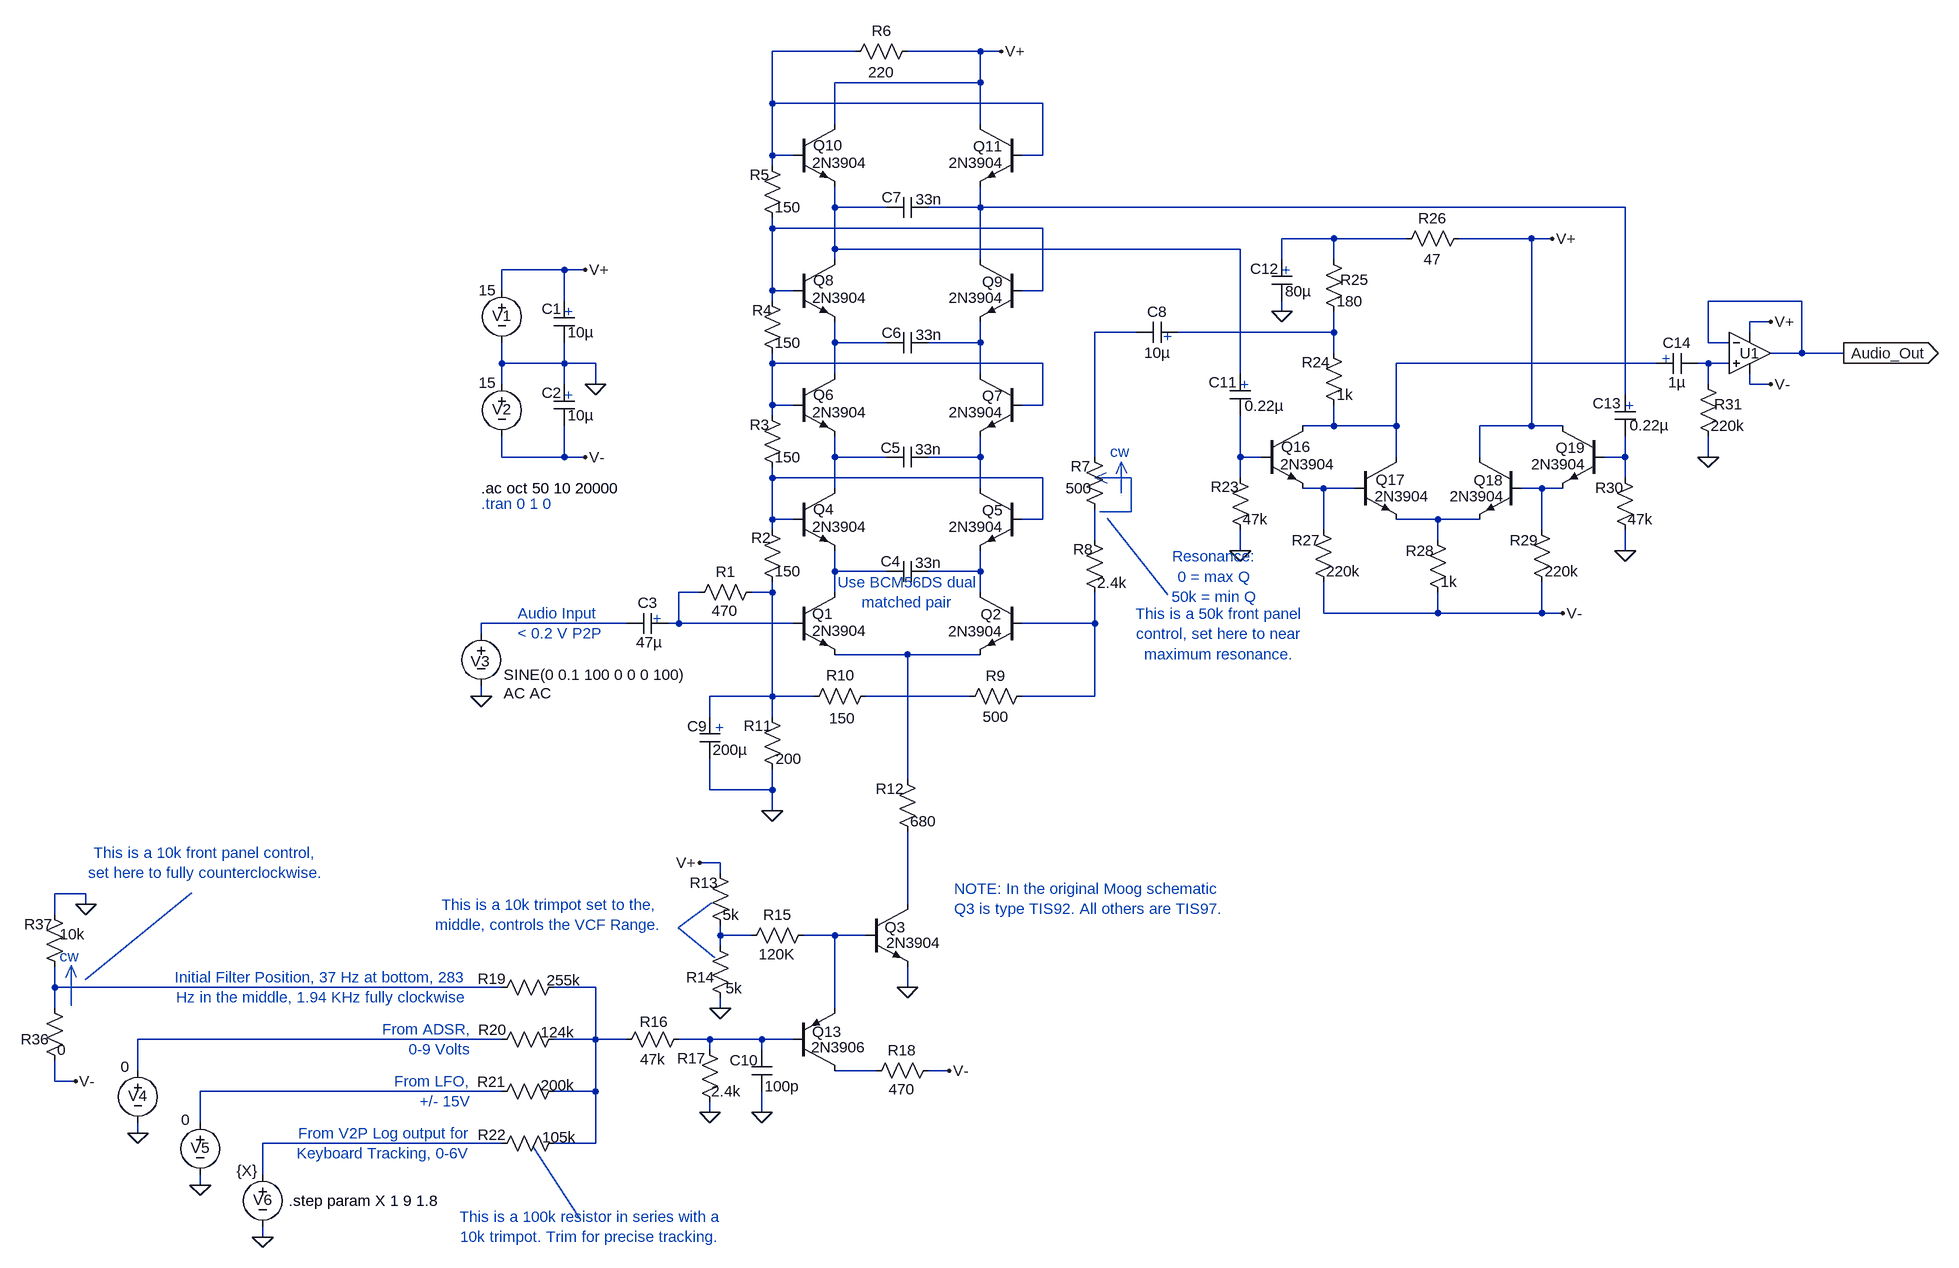
[diagram p0: schematic VCF-simulation.asc]
VCF-simulation.asc, the LTspice schematic file:
Version 4
SHEET 1 3972 1940
WIRE 1392 16 1264 16
WIRE 1584 16 1472 16
WIRE 1616 16 1584 16
WIRE 1584 64 1584 16
WIRE 1584 64 1360 64
WIRE 1264 96 1264 16
WIRE 1680 96 1264 96
WIRE 1360 128 1360 64
WIRE 1584 128 1584 64
WIRE 1264 176 1264 96
WIRE 1296 176 1264 176
WIRE 1680 176 1680 96
WIRE 1680 176 1648 176
WIRE 1264 192 1264 176
WIRE 1360 256 1360 224
WIRE 1440 256 1360 256
WIRE 1584 256 1584 224
WIRE 1584 256 1504 256
WIRE 2576 256 1584 256
WIRE 1264 288 1264 272
WIRE 1680 288 1264 288
WIRE 2128 304 2048 304
WIRE 2240 304 2128 304
WIRE 2432 304 2320 304
WIRE 2464 304 2432 304
WIRE 1360 320 1360 256
WIRE 1984 320 1360 320
WIRE 1360 336 1360 320
WIRE 1584 336 1584 256
WIRE 2048 336 2048 304
WIRE 2128 336 2128 304
WIRE 944 352 848 352
WIRE 976 352 944 352
WIRE 848 384 848 352
WIRE 1264 384 1264 288
WIRE 1296 384 1264 384
WIRE 1680 384 1680 288
WIRE 1680 384 1648 384
WIRE 944 400 944 352
WIRE 1264 400 1264 384
WIRE 2848 400 2704 400
WIRE 2048 416 2048 400
WIRE 2800 432 2768 432
WIRE 1824 448 1760 448
WIRE 2128 448 2128 416
WIRE 2128 448 1888 448
WIRE 2768 448 2768 432
WIRE 1360 464 1360 432
WIRE 1440 464 1360 464
WIRE 1584 464 1584 432
WIRE 1584 464 1504 464
WIRE 2704 464 2704 400
WIRE 2736 464 2704 464
WIRE 2128 480 2128 448
WIRE 2848 480 2848 400
WIRE 2848 480 2800 480
WIRE 2912 480 2848 480
WIRE 848 496 848 464
WIRE 944 496 944 464
WIRE 944 496 848 496
WIRE 992 496 944 496
WIRE 1264 496 1264 480
WIRE 1680 496 1264 496
WIRE 2624 496 2224 496
WIRE 2704 496 2688 496
WIRE 2736 496 2704 496
WIRE 1360 512 1360 464
WIRE 1584 512 1584 464
WIRE 1984 512 1984 320
WIRE 848 528 848 496
WIRE 944 528 944 496
WIRE 992 528 992 496
WIRE 2704 528 2704 496
WIRE 2768 528 2768 512
WIRE 2800 528 2768 528
WIRE 2576 544 2576 256
WIRE 1264 560 1264 496
WIRE 1296 560 1264 560
WIRE 1680 560 1680 496
WIRE 1680 560 1648 560
WIRE 1264 576 1264 560
WIRE 2128 592 2128 560
WIRE 2128 592 2080 592
WIRE 2224 592 2224 496
WIRE 2224 592 2128 592
WIRE 2432 592 2432 304
WIRE 2432 592 2352 592
WIRE 2480 592 2432 592
WIRE 848 640 848 608
WIRE 944 640 944 592
WIRE 944 640 848 640
WIRE 976 640 944 640
WIRE 1360 640 1360 608
WIRE 1440 640 1360 640
WIRE 1584 640 1584 608
WIRE 1584 640 1504 640
WIRE 1760 640 1760 448
WIRE 1984 640 1984 576
WIRE 2016 640 1984 640
WIRE 2224 640 2224 592
WIRE 2352 640 2352 592
WIRE 2576 640 2576 608
WIRE 2576 640 2544 640
WIRE 2704 640 2704 608
WIRE 1264 672 1264 656
WIRE 1680 672 1264 672
WIRE 1984 672 1984 640
WIRE 2576 672 2576 640
WIRE 1360 688 1360 640
WIRE 1584 688 1584 640
WIRE 2112 688 2080 688
WIRE 2160 688 2112 688
WIRE 2448 688 2416 688
WIRE 2480 688 2448 688
WIRE 1264 736 1264 672
WIRE 1296 736 1264 736
WIRE 1680 736 1680 672
WIRE 1680 736 1648 736
WIRE 2288 736 2224 736
WIRE 2352 736 2288 736
WIRE 1264 752 1264 736
WIRE 2112 752 2112 688
WIRE 2448 752 2448 688
WIRE 1760 768 1760 720
WIRE 2288 768 2288 736
WIRE 1984 784 1984 752
WIRE 2576 784 2576 752
WIRE 1360 816 1360 784
WIRE 1440 816 1360 816
WIRE 1584 816 1584 784
WIRE 1584 816 1504 816
WIRE 1152 848 1120 848
WIRE 1264 848 1264 832
WIRE 1264 848 1232 848
WIRE 1360 848 1360 816
WIRE 1584 848 1584 816
WIRE 2112 880 2112 832
WIRE 2288 880 2288 848
WIRE 2288 880 2112 880
WIRE 2448 880 2448 832
WIRE 2448 880 2288 880
WIRE 2480 880 2448 880
WIRE 1040 896 816 896
WIRE 1120 896 1120 848
WIRE 1120 896 1104 896
WIRE 1296 896 1120 896
WIRE 1760 896 1760 848
WIRE 1760 896 1648 896
WIRE 816 912 816 896
WIRE 1472 944 1360 944
WIRE 1584 944 1472 944
WIRE 816 1008 816 992
WIRE 1264 1008 1264 848
WIRE 1264 1008 1168 1008
WIRE 1328 1008 1264 1008
WIRE 1568 1008 1408 1008
WIRE 1760 1008 1760 896
WIRE 1760 1008 1648 1008
WIRE 1168 1040 1168 1008
WIRE 1264 1040 1264 1008
WIRE 1472 1136 1472 944
WIRE 1168 1152 1168 1104
WIRE 1264 1152 1264 1120
WIRE 1264 1152 1168 1152
WIRE 1264 1184 1264 1152
WIRE 1184 1264 1152 1264
WIRE 1184 1280 1184 1264
WIRE 208 1312 160 1312
WIRE 208 1328 208 1312
WIRE 1472 1328 1472 1216
WIRE 160 1344 160 1312
WIRE 1184 1376 1184 1360
WIRE 1232 1376 1184 1376
WIRE 1360 1376 1312 1376
WIRE 1408 1376 1360 1376
WIRE 1184 1392 1184 1376
WIRE 160 1456 160 1424
WIRE 848 1456 160 1456
WIRE 992 1456 928 1456
WIRE 1472 1456 1472 1424
WIRE 160 1488 160 1456
WIRE 1184 1488 1184 1472
WIRE 1360 1488 1360 1376
WIRE 848 1536 288 1536
WIRE 992 1536 992 1456
WIRE 992 1536 928 1536
WIRE 1040 1536 992 1536
WIRE 1168 1536 1120 1536
WIRE 1248 1536 1168 1536
WIRE 1296 1536 1248 1536
WIRE 1168 1552 1168 1536
WIRE 1248 1552 1248 1536
WIRE 288 1584 288 1536
WIRE 1424 1584 1360 1584
WIRE 1536 1584 1504 1584
WIRE 160 1600 160 1568
WIRE 192 1600 160 1600
WIRE 848 1616 384 1616
WIRE 992 1616 992 1536
WIRE 992 1616 928 1616
WIRE 1168 1648 1168 1632
WIRE 1248 1648 1248 1616
WIRE 384 1664 384 1616
WIRE 288 1680 288 1664
WIRE 848 1696 480 1696
WIRE 992 1696 992 1616
WIRE 992 1696 928 1696
WIRE 480 1744 480 1696
WIRE 384 1760 384 1744
WIRE 480 1840 480 1824
FLAG 992 528 0
FLAG 976 352 V+
FLAG 976 640 V-
FLAG 288 1680 0
FLAG 1472 1456 0
FLAG 1264 1184 0
FLAG 1984 784 0
FLAG 2576 784 0
FLAG 2480 880 V-
FLAG 2464 304 V+
FLAG 2048 416 0
FLAG 2800 432 V+
FLAG 2800 528 V-
FLAG 2704 640 0
FLAG 2912 480 Audio_Out
IOPIN 2912 480 Out
FLAG 816 1008 0
FLAG 1616 16 V+
FLAG 384 1760 0
FLAG 480 1840 0
FLAG 1536 1584 V-
FLAG 1184 1488 0
FLAG 1152 1264 V+
FLAG 1168 1648 0
FLAG 1248 1648 0
FLAG 192 1600 V-
FLAG 208 1328 0
SYMBOL voltage 848 512 M0
WINDOW 0 0 70 Bottom 2
WINDOW 3 22 -2 Top 2
WINDOW 123 0 0 Left 2
WINDOW 39 -60 56 VBottom 2
SYMATTR InstName V2
SYMATTR Value 15
SYMBOL cap 928 528 R0
WINDOW 0 -19 13 Left 2
WINDOW 3 21 48 Left 2
SYMATTR InstName C2
SYMATTR Value 10µ
SYMBOL voltage 848 368 M0
WINDOW 0 0 70 Bottom 2
WINDOW 3 22 0 Top 2
WINDOW 123 0 0 Left 2
WINDOW 39 -60 56 VBottom 2
SYMATTR InstName V1
SYMATTR Value 15
SYMBOL cap 928 400 R0
WINDOW 0 -19 12 Left 2
WINDOW 3 21 48 Left 2
SYMATTR InstName C1
SYMATTR Value 10µ
SYMBOL voltage 288 1568 M0
WINDOW 0 0 70 Bottom 2
WINDOW 3 13 10 Left 2
WINDOW 123 0 0 Left 2
WINDOW 39 -60 56 VBottom 2
SYMATTR InstName V4
SYMATTR Value 0
SYMBOL npn 1296 848 R0
WINDOW 0 29 33 Left 2
WINDOW 3 29 59 Left 2
SYMATTR InstName Q1
SYMATTR Value 2N3904
SYMBOL npn 1648 848 M0
WINDOW 0 31 34 Left 2
WINDOW 3 29 60 Left 2
SYMATTR InstName Q2
SYMATTR Value 2N3904
SYMBOL npn 1408 1328 R0
WINDOW 0 29 35 Left 2
WINDOW 3 31 59 Left 2
SYMATTR InstName Q3
SYMATTR Value 2N3904
SYMBOL res 1488 1232 R180
WINDOW 0 21 82 Left 2
WINDOW 3 12 32 Right 2
SYMATTR InstName R12
SYMATTR Value 680
SYMBOL cap 1104 880 R90
WINDOW 0 0 32 VBottom 2
WINDOW 3 29 29 VTop 2
SYMATTR InstName C3
SYMATTR Value 47µ
SYMBOL npn 1296 688 R0
WINDOW 0 31 32 Left 2
WINDOW 3 29 59 Left 2
SYMATTR InstName Q4
SYMATTR Value 2N3904
SYMBOL npn 1648 688 M0
WINDOW 0 29 34 Left 2
WINDOW 3 28 59 Left 2
SYMATTR InstName Q5
SYMATTR Value 2N3904
SYMBOL cap 1504 800 R90
WINDOW 0 16 58 VBottom 2
WINDOW 3 -13 0 VTop 2
SYMATTR InstName C4
SYMATTR Value 33n
SYMBOL res 1280 848 R180
WINDOW 0 18 84 Left 2
WINDOW 3 12 32 Right 2
SYMATTR InstName R2
SYMATTR Value 150
SYMBOL res 1424 992 R90
WINDOW 0 -1 55 VBottom 2
WINDOW 3 34 52 VTop 2
SYMATTR InstName R10
SYMATTR Value 150
SYMBOL res 1280 1136 R180
WINDOW 0 16 83 Left 2
WINDOW 3 11 32 Right 2
SYMATTR InstName R11
SYMATTR Value 200
SYMBOL res 1248 832 R90
WINDOW 0 0 56 VBottom 2
WINDOW 3 29 57 VTop 2
SYMATTR InstName R1
SYMATTR Value 470
SYMBOL cap 1184 1104 R180
WINDOW 0 20 50 Left 2
WINDOW 3 12 14 Right 2
SYMATTR InstName C9
SYMATTR Value 200µ
SYMBOL res 1776 736 R180
WINDOW 0 22 82 Left 2
WINDOW 3 20 48 Left 2
SYMATTR InstName R7
SYMATTR Value 500
SYMBOL npn 1296 512 R0
WINDOW 0 31 32 Left 2
WINDOW 3 29 59 Left 2
SYMATTR InstName Q6
SYMATTR Value 2N3904
SYMBOL npn 1648 512 M0
WINDOW 0 29 34 Left 2
WINDOW 3 28 59 Left 2
SYMATTR InstName Q7
SYMATTR Value 2N3904
SYMBOL cap 1504 624 R90
WINDOW 0 17 58 VBottom 2
WINDOW 3 -12 0 VTop 2
SYMATTR InstName C5
SYMATTR Value 33n
SYMBOL res 1280 672 R180
WINDOW 0 20 82 Left 2
WINDOW 3 12 32 Right 2
SYMATTR InstName R3
SYMATTR Value 150
SYMBOL npn 1296 336 R0
WINDOW 0 31 32 Left 2
WINDOW 3 29 59 Left 2
SYMATTR InstName Q8
SYMATTR Value 2N3904
SYMBOL npn 1648 336 M0
WINDOW 0 29 34 Left 2
WINDOW 3 28 59 Left 2
SYMATTR InstName Q9
SYMATTR Value 2N3904
SYMBOL cap 1504 448 R90
WINDOW 0 16 56 VBottom 2
WINDOW 3 -12 -1 VTop 2
SYMATTR InstName C6
SYMATTR Value 33n
SYMBOL res 1280 496 R180
WINDOW 0 16 82 Left 2
WINDOW 3 12 32 Right 2
SYMATTR InstName R4
SYMATTR Value 150
SYMBOL npn 1296 128 R0
WINDOW 0 31 32 Left 2
WINDOW 3 29 59 Left 2
SYMATTR InstName Q10
SYMATTR Value 2N3904
SYMBOL npn 1648 128 M0
WINDOW 0 29 34 Left 2
WINDOW 3 28 59 Left 2
SYMATTR InstName Q11
SYMATTR Value 2N3904
SYMBOL cap 1504 240 R90
WINDOW 0 16 56 VBottom 2
WINDOW 3 -12 -1 VTop 2
SYMATTR InstName C7
SYMATTR Value 33n
SYMBOL res 1280 288 R180
WINDOW 0 20 82 Left 2
WINDOW 3 12 32 Right 2
SYMATTR InstName R5
SYMATTR Value 150
SYMBOL npn 2016 592 R0
WINDOW 0 31 32 Left 2
WINDOW 3 29 59 Left 2
SYMATTR InstName Q16
SYMATTR Value 2N3904
SYMBOL npn 2160 640 R0
WINDOW 0 32 35 Left 2
WINDOW 3 31 60 Left 2
SYMATTR InstName Q17
SYMATTR Value 2N3904
SYMBOL npn 2416 640 M0
WINDOW 0 27 36 Left 2
WINDOW 3 25 60 Left 2
SYMATTR InstName Q18
SYMATTR Value 2N3904
SYMBOL npn 2544 592 M0
WINDOW 0 29 34 Left 2
WINDOW 3 28 59 Left 2
SYMATTR InstName Q19
SYMATTR Value 2N3904
SYMBOL res 2304 864 R180
WINDOW 0 21 80 Left 2
WINDOW 3 12 32 Right 2
SYMATTR InstName R28
SYMATTR Value 1k
SYMBOL res 2128 848 R180
WINDOW 0 21 80 Left 2
WINDOW 3 12 32 Right 2
SYMATTR InstName R27
SYMATTR Value 220k
SYMBOL res 2464 848 R180
WINDOW 0 21 80 Left 2
WINDOW 3 12 32 Right 2
SYMATTR InstName R29
SYMATTR Value 220k
SYMBOL res 2592 768 R180
WINDOW 0 18 81 Left 2
WINDOW 3 12 32 Right 2
SYMATTR InstName R30
SYMATTR Value 47k
SYMBOL res 2000 768 R180
WINDOW 0 17 82 Left 2
WINDOW 3 12 32 Right 2
SYMATTR InstName R23
SYMATTR Value 47k
SYMBOL cap 1968 512 R0
WINDOW 0 -33 13 Left 2
WINDOW 3 23 49 Left 2
SYMATTR InstName C11
SYMATTR Value 0.22µ
SYMBOL cap 2560 544 R0
WINDOW 0 -34 13 Left 2
WINDOW 3 23 47 Left 2
SYMATTR InstName C13
SYMATTR Value 0.22µ
SYMBOL res 2144 576 R180
WINDOW 0 21 82 Left 2
WINDOW 3 12 32 Right 2
SYMATTR InstName R24
SYMATTR Value 1k
SYMBOL res 2144 432 R180
WINDOW 0 -38 65 Left 2
WINDOW 3 12 32 Right 2
SYMATTR InstName R25
SYMATTR Value 180
SYMBOL cap 1824 464 R270
WINDOW 0 32 32 VTop 2
WINDOW 3 0 32 VBottom 2
SYMATTR InstName C8
SYMATTR Value 10µ
SYMBOL res 2224 320 R270
WINDOW 0 32 56 VTop 2
WINDOW 3 0 56 VBottom 2
SYMATTR InstName R26
SYMATTR Value 47
SYMBOL cap 2032 336 R0
WINDOW 0 -33 14 Left 2
WINDOW 3 21 49 Left 2
SYMATTR InstName C12
SYMATTR Value 80µ
SYMBOL OpAmps\\UniversalOpamp2 2768 480 R0
WINDOW 0 15 0 Right 2
SYMATTR InstName U1
SYMBOL res 2720 624 R180
WINDOW 0 -37 65 Left 2
WINDOW 3 12 32 Right 2
SYMATTR InstName R31
SYMATTR Value 220k
SYMBOL cap 2688 480 R90
WINDOW 0 0 32 VBottom 2
WINDOW 3 29 32 VTop 2
SYMATTR InstName C14
SYMATTR Value 1µ
SYMBOL voltage 816 896 R0
WINDOW 0 -16 58 Left 2
WINDOW 3 35 79 Left 2
WINDOW 123 35 107 Left 2
WINDOW 39 0 0 Left 0
SYMATTR InstName V3
SYMATTR Value SINE(0 0.1 100 0 0 0 100)
SYMATTR Value2 AC AC
SYMBOL res 1376 32 R270
WINDOW 0 32 56 VTop 2
WINDOW 3 0 56 VBottom 2
SYMATTR InstName R6
SYMATTR Value 220
SYMBOL res 1776 864 R180
WINDOW 0 18 82 Left 2
WINDOW 3 12 31 Right 2
SYMATTR InstName R8
SYMATTR Value 2.4k
SYMBOL res 1552 1024 R270
WINDOW 0 32 56 VTop 2
WINDOW 3 0 56 VBottom 2
SYMATTR InstName R9
SYMATTR Value 500
SYMBOL res 1136 1520 R90
WINDOW 0 4 54 VBottom 2
WINDOW 3 31 56 VTop 2
SYMATTR InstName R16
SYMATTR Value 47k
SYMBOL res 944 1600 R90
WINDOW 0 17 112 VBottom 2
WINDOW 3 -9 10 VTop 2
SYMATTR InstName R21
SYMATTR Value 200k
SYMBOL res 944 1520 R90
WINDOW 0 17 110 VBottom 2
WINDOW 3 -11 10 VTop 2
SYMATTR InstName R20
SYMATTR Value 124k
SYMBOL res 944 1440 R90
WINDOW 0 18 111 VBottom 2
WINDOW 3 -11 1 VTop 2
SYMATTR InstName R19
SYMATTR Value 255k
SYMBOL voltage 384 1648 M0
WINDOW 0 0 70 Bottom 2
WINDOW 3 23 27 Bottom 2
WINDOW 123 0 0 Left 2
WINDOW 39 -60 56 VBottom 2
SYMATTR InstName V5
SYMATTR Value 0
SYMBOL res 944 1680 R90
WINDOW 0 18 111 VBottom 2
WINDOW 3 -9 8 VTop 2
SYMATTR InstName R22
SYMATTR Value 105k
SYMBOL voltage 480 1728 M0
WINDOW 0 0 70 Bottom 2
WINDOW 3 8 10 Left 2
WINDOW 123 0 0 Left 2
WINDOW 39 -60 56 VBottom 2
SYMATTR InstName V6
SYMATTR Value {X}
SYMBOL pnp 1296 1584 M180
WINDOW 0 29 60 Left 2
WINDOW 3 28 36 Left 2
SYMATTR InstName Q13
SYMATTR Value 2N3906
SYMBOL res 1520 1568 R90
WINDOW 0 0 56 VBottom 2
WINDOW 3 29 57 VTop 2
SYMATTR InstName R18
SYMATTR Value 470
SYMBOL res 1200 1488 R180
WINDOW 0 24 48 Left 2
WINDOW 3 8 31 Right 2
SYMATTR InstName R14
SYMATTR Value 5k
SYMBOL res 1200 1376 R180
WINDOW 0 19 81 Left 2
WINDOW 3 12 32 Right 2
SYMATTR InstName R13
SYMATTR Value 5k
SYMBOL res 1328 1360 R90
WINDOW 0 0 56 VBottom 2
WINDOW 3 29 57 VTop 2
SYMATTR InstName R15
SYMATTR Value 120K
SYMBOL res 1184 1648 R180
WINDOW 0 22 83 Left 2
WINDOW 3 14 32 Right 2
SYMATTR InstName R17
SYMATTR Value 2.4k
SYMBOL cap 1264 1616 R180
WINDOW 0 21 48 Left 2
WINDOW 3 12 8 Right 2
SYMATTR InstName C10
SYMATTR Value 100p
SYMBOL res 176 1584 R180
WINDOW 0 24 48 Left 2
WINDOW 3 12 32 Right 2
SYMATTR InstName R36
SYMATTR Value 0
SYMBOL res 176 1440 R180
WINDOW 0 19 81 Left 2
WINDOW 3 8 66 Right 2
SYMATTR InstName R37
SYMATTR Value 10k
TEXT 944 544 Left 2 ;+
TEXT 944 416 Left 2 ;+
TEXT 1080 888 Left 2 ;+
TEXT 1176 1056 Left 2 ;+
TEXT 1872 448 VRight 2 ;+
TEXT 2048 352 Left 2 ;+
TEXT 1944 824 Center 2 ;Resonance:\n0 = max Q\n50k = min Q
TEXT 816 688 Left 2 !.ac oct 50 10 20000
TEXT 816 712 Left 2 ;.tran 0 1 0
TEXT 2632 488 Left 2 ;+
TEXT 872 880 Left 2 ;Audio Input\n< 0.2 V P2P
TEXT 520 1784 Left 2 !.step param X 1 9 1.8
TEXT 2576 560 Left 2 ;+
TEXT 1984 528 Left 2 ;+
TEXT 800 1520 Right 2 ;From ADSR,\n0-9 Volts
TEXT 800 1600 Right 2 ;From LFO,\n+/- 15V
TEXT 800 1680 Right 2 ;From V2P Log output for\nKeyboard Tracking, 0-6V
TEXT 920 1344 Center 2 ;This is a 10k trimpot set to the,\nmiddle, controls the VCF Range.
TEXT 792 1440 Right 2 ;Initial Filter Position, 37 Hz at bottom, 283\nHz in the middle, 1.94 KHz fully clockwise
TEXT 392 1264 Center 2 ;This is a 10k front panel control,\nset here to fully counterclockwise.
TEXT 168 1408 Left 2 ;cw
TEXT 984 1824 Center 2 ;This is a 100k resistor in series with a\n10k trimpot. Trim for precise tracking.
TEXT 1472 848 Center 2 ;Use BCM56DS dual\nmatched pair
TEXT 1784 632 Left 2 ;cw
TEXT 1952 912 Center 2 ;This is a 50k front panel\ncontrol, set here to near\nmaximum resonance.
TEXT 1544 1304 Left 2 ;NOTE: In the original Moog schematic\nQ3 is type TIS92. All others are TIS97.
LINE Normal 1816 724 1768 724
LINE Normal 1816 672 1816 724
LINE Normal 1760 672 1816 672
LINE Normal 1760 672 1760 672
LINE Normal 1778 664 1760 672
LINE Normal 1760 672 1778 664
LINE Normal 1779 680 1760 672
LINE Normal 1801 696 1801 648
LINE Normal 1801 699 1801 699
LINE Normal 1801 647 1809 665
LINE Normal 1801 647 1793 666
LINE Normal 1119 1364 1171 1326
LINE Normal 1175 1410 1119 1364
LINE Normal 207 1444 371 1310
LINE Normal 185 1484 185 1423
LINE Normal 185 1487 185 1487
LINE Normal 185 1422 193 1440
LINE Normal 185 1422 177 1441
LINE Normal 967 1810 895 1700
LINE Normal 1872 852 1779 734

The netlist it stands for:
* VCF-simulation.asc
V2 0 V- 15
C2 0 V- 10µ
V1 V+ 0 15
C1 V+ 0 10µ
V4 N035 0 0
Q1 N022 N024 N028 0 2N3904
Q2 N023 N027 N028 0 2N3904
Q3 N030 N032 0 0 2N3904
R12 N030 N028 680
C3 N024 N026 47µ
Q4 N013 N017 N022 0 2N3904
Q5 N014 N017 N023 0 2N3904
C4 N023 N022 33n
R2 N025 N017 150
R10 N029 N025 150
R11 0 N025 200
R1 N025 N024 470
C9 0 N025 200µ
R7 N021 N006 500
Q6 N008 N010 N013 0 2N3904
Q7 N009 N010 N014 0 2N3904
C5 N014 N013 33n
R3 N017 N010 150
Q8 N002 N004 N008 0 2N3904
Q9 N003 N004 N009 0 2N3904
C6 N009 N008 33n
R4 N010 N004 150
Q10 V+ N001 N002 0 2N3904
Q11 V+ N001 N003 0 2N3904
C7 N003 N002 33n
R5 N004 N001 150
Q16 N011 N015 N018 0 2N3904
Q17 N011 N018 N020 0 2N3904
Q18 V+ N019 N020 0 2N3904
Q19 V+ N016 N019 0 2N3904
R28 V- N020 1k
R27 V- N018 220k
R29 V- N019 220k
R30 0 N016 47k
R23 0 N015 47k
C11 N002 N015 0.22µ
C13 N003 N016 0.22µ
R24 N011 N007 1k
R25 N007 N005 180
C8 N006 N007 10µ
R26 N005 V+ 47
C12 N005 0 80µ
XU1 N012 Audio_Out V+ V- Audio_Out level.2 Avol=1Meg GBW=10Meg Slew=10Meg ilimit=25m rail=0 Vos=0 phimargin=45 en=0 enk=0 in=0 ink=0 Rin=500Meg  ; pins IN+ IN- V+ V- OUT
R31 0 N012 220k
C14 N012 N011 1µ
V3 N026 0 SINE(0 0.1 100 0 0 0 100) AC AC
R6 N001 V+ 220
R8 N027 N021 2.4k
R9 N029 N027 500
R16 N036 N034 47k
R21 N034 N038 200k
R20 N034 N035 124k
R19 N034 N033 255k
V5 N038 0 0
R22 N034 N039 105k
V6 N039 0 {X}
Q13 N037 N036 N032 0 2N3906
R18 V- N037 470
R14 0 N031 5k
R13 N031 V+ 5k
R15 N032 N031 120K
R17 0 N036 2.4k
C10 0 N036 100p
R36 V- N033 0
R37 N033 0 10k
.model NPN NPN
.model PNP PNP
.lib standard.bjt
* +
* +
* +
* +
* +
* +
* Resonance:
* 0 = max Q
* 50k = min Q
.ac oct 50 10 20000
* .tran 0 1 0
* +
* Audio Input
* < 0.2 V P2P
.step param X 1 9 1.8
* +
* +
* From ADSR,
* 0-9 Volts
* From LFO,
* +/- 15V
* From V2P Log output for
* Keyboard Tracking, 0-6V
* This is a 10k trimpot set to the,
* middle, controls the VCF Range.
* Initial Filter Position, 37 Hz at bottom, 283
* Hz in the middle, 1.94 KHz fully clockwise
* This is a 10k front panel control,
* set here to fully counterclockwise.
* cw
* This is a 100k resistor in series with a
* 10k trimpot. Trim for precise tracking.
* Use BCM56DS dual
* matched pair
* cw
* This is a 50k front panel
* control, set here to near
* maximum resonance.
* NOTE: In the original Moog schematic
* Q3 is type TIS92. All others are TIS97.
.lib UniversalOpamps2.sub
.backanno
.end